# Altium schematic sheet Steering_Daughterboard.SchDoc
size A4; SheetNumber: 2; SheetTotal: 2
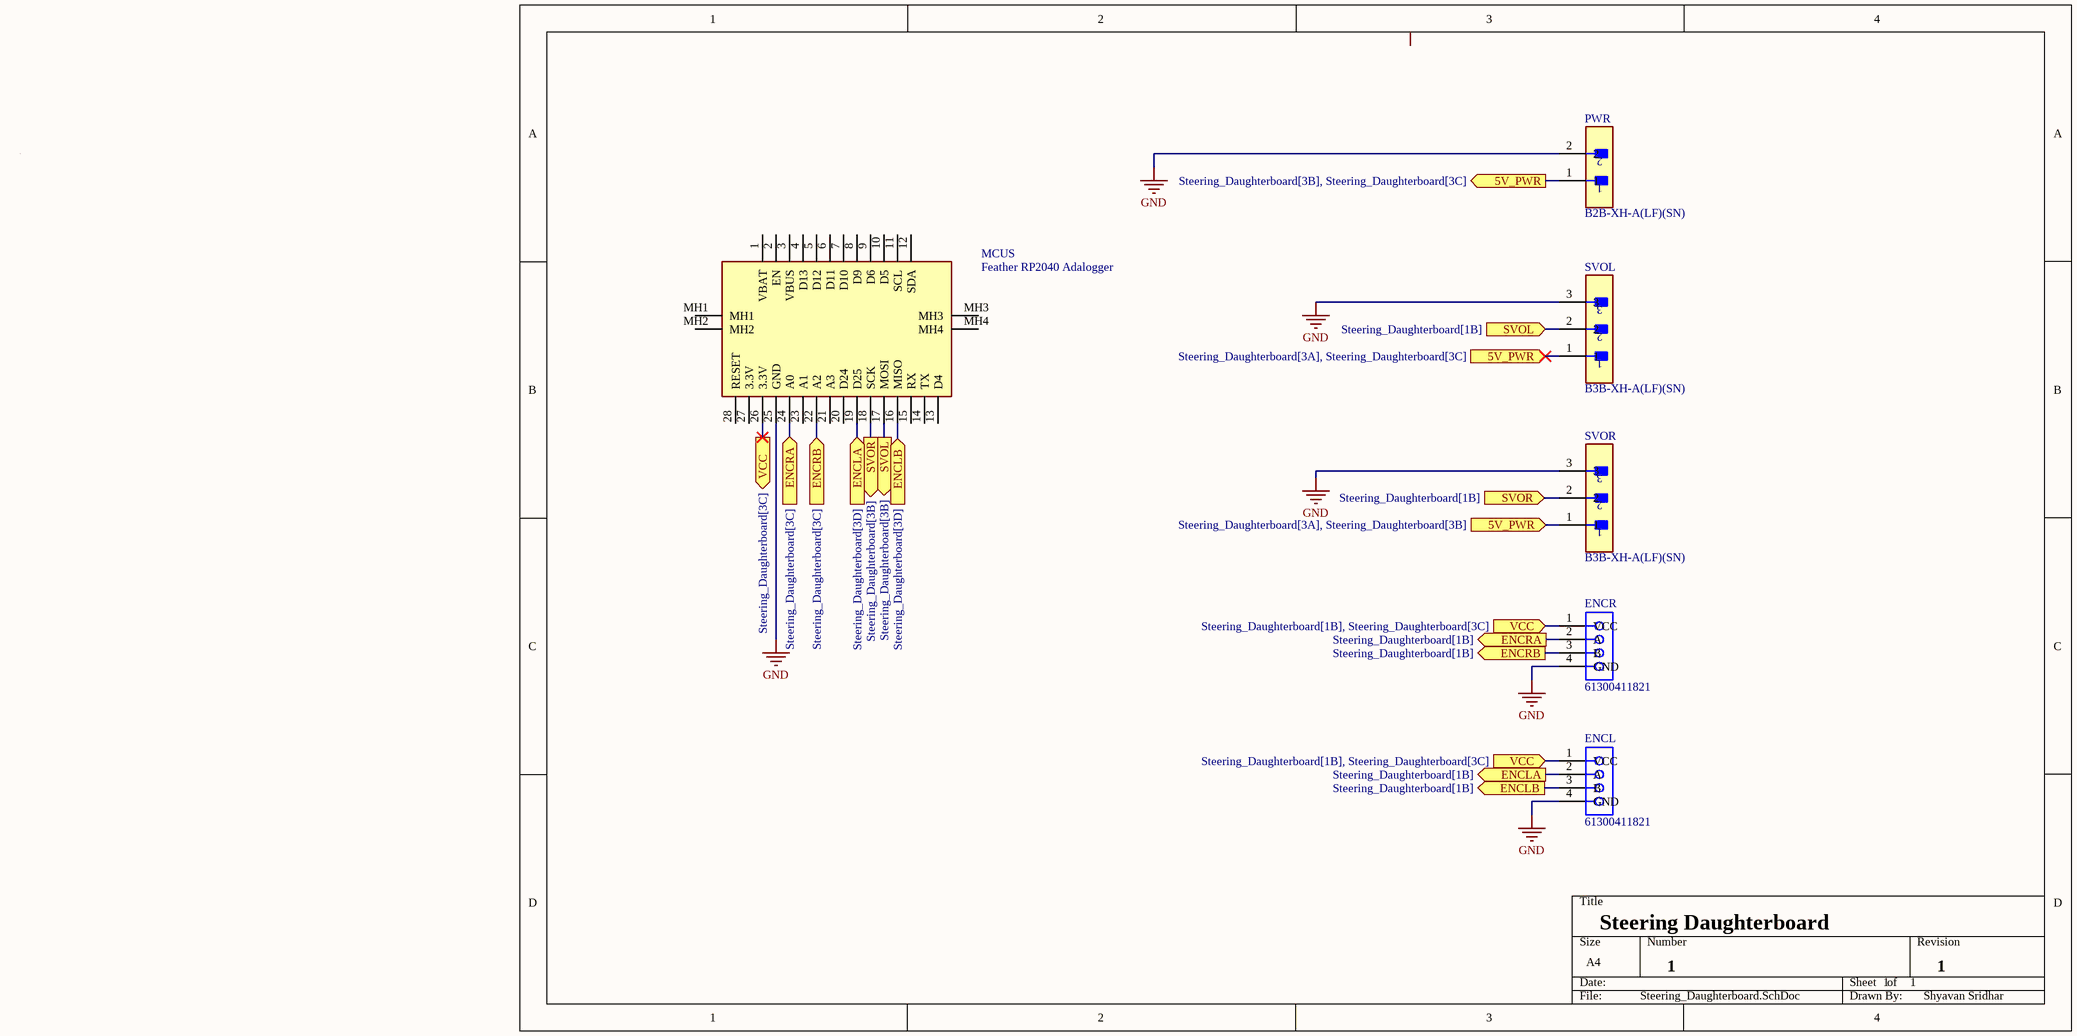
[diagram p0: Steering_Daughterboard.SchDoc]

## Parts
ENCL  61300411821  [61300411821]
ENCR  61300411821  [61300411821]
MCUS  Feather RP2040 Adalogger  [2796]
PWR  B2B-XH-A(LF)(SN)  [FP-B2B-XH-A_LF_SN-MFG]
SVOL  B3B-XH-A(LF)(SN)  [FP-B3B-XH-A_LF_SN-MFG]
SVOR  B3B-XH-A(LF)(SN)  [FP-B3B-XH-A_LF_SN-MFG]

## Ports
5V_PWR (in, see Steering_Daughterboard[3A], Steering_Daughterboard[3B]), 5V_PWR (in, see Steering_Daughterboard[3A], Steering_Daughterboard[3C]), 5V_PWR (out, see Steering_Daughterboard[3B], Steering_Daughterboard[3C]), ENCLA (in, see Steering_Daughterboard[3D]), ENCLA (out, see Steering_Daughterboard[1B]), ENCLB (in, see Steering_Daughterboard[3D]), ENCLB (out, see Steering_Daughterboard[1B]), ENCRA (in, see Steering_Daughterboard[3C]), ENCRA (out, see Steering_Daughterboard[1B]), ENCRB (in, see Steering_Daughterboard[3C]), ENCRB (out, see Steering_Daughterboard[1B]), SVOL (in, see Steering_Daughterboard[1B]), SVOL (out, see Steering_Daughterboard[3B]), SVOR (in, see Steering_Daughterboard[1B]), SVOR (out, see Steering_Daughterboard[3B]), VCC (in, see Steering_Daughterboard[1B], Steering_Daughterboard[3C]), VCC (out, see Steering_Daughterboard[3C])

## Nets
GND: ENCL.4(GND) ENCR.4(GND) MCUS.25(GND) PWR.2 SVOL.3 SVOR.3
5V_PWR: PWR.1 SVOL.1 SVOR.1 ; port 5V_PWR
ENCLA: ENCL.2(A) MCUS.19(D25) ; port ENCLA
ENCLB: ENCL.3(B) MCUS.16(MISO) ; port ENCLB
ENCRA: ENCR.2(A) MCUS.24(A0) ; port ENCRA
ENCRB: ENCR.3(B) MCUS.22(A2) ; port ENCRB
SVOL: MCUS.17(MOSI) SVOL.2 ; port SVOL
SVOR: MCUS.18(SCK) SVOR.2 ; port SVOR
VCC: ENCL.1(VCC) ENCR.1(VCC) MCUS.26(3.3V) ; port VCC

Not connected (* = marked no-connect by the designer): MCUS 1(VBAT) 2(EN) 3(VBUS) 4(D13) 5(D12) 6(D11) 7(D10) 8(D9) 9(D6) 10(D5) 11(SCL) 12(SDA) 13(D4) 14(TX) 15(RX) 20(D24) 21(A3) 23(A1) 27(3.3V) 28(RESET) MH1 MH2 MH3 MH4

## Notes on the sheet
- Steering Daughterboard
- 1
- Shyavan Sridhar

## Library data of the parts
ENCL ENCR = CMP-1502-01316-3: NexarPartId: 61924712; Contact Resistance: 20mΩ; Gender: Female; Current Rating: 3A; Operating Supply Voltage: 250V; RoHS: Non-Compliant; Number of Pins: 4; Orientation: Vertical; Lead Pitch: 2.54mm
MCUS = 2796: Adafruit Microcontroller; Manufacturer_Part_Number: 4884; Datasheet Link: https://learn.adafruit.com/adafruit-feather-rp2040-adalogger/; Height: 8mm; Manufacturer_Name: Adafruit; Mouser Part Number: 485-5980; Mouser Price/Stock: https://www.mouser.com/ProductDetail/Adafruit/5980?qs=IKkN%2F947nfCnlS5PgbpnkA%3D%3D; Arrow Part Number: 4884; Arrow Price/Stock: https://www.arrow.com/en/products/4884/adafruit-industries
PWR = CMP-2000-05888-3: CONN HEADER VERT 2POS 2.5MM; Current Rating: 3A; Voltage Rating: 250V; Number of Contacts: 2; Contact Resistance: 20mR; Wire/Cable Gauge: 22AWG; Insulation Resistance: 1GR; Connector Type: Male Pin; Packaging: Bulk; Contact Material: Brass; Lead Free: Lead Free; Orientation: Straight; Contact Plating: Tin; Max Current Rating: 3A; Termination: Solder; Fastening Type: Detent; Depth: 5.75mm; Housing Material: Polyamide; REACH SVHC: No SVHC; Series: XH; Voltage Rating (AC): 250V; Number of Positions: 2; Color: Natural; Contact Type: Male Pin; Max Voltage Rating (DC): 250V; Pitch: 2.5mm; Lead Pitch: 2.5mm; Mount: Through Hole; Max Operating Temperature: 85°C; Length: 7.4mm; Max Voltage Rating (AC): 250V; Min Operating Temperature: -25°C; Number of Rows: 1; Housing Color: White
SVOL SVOR = CMP-17439-000014-3: CONN HEADER VERT 3POS 2.5MM; Max Voltage Rating (DC): 250V; Number of Positions: 3; Current Rating: 3A; Gender: Male; Wire/Cable Gauge: 22AWG; Contact Resistance: 20mR; Insulation Resistance: 1GR; Insulation Material: Nylon; Contact Plating: Tin; Depth: 5.75mm; Contact Type: Male Pin; Max Operating Temperature: 85°C; Insulation Color: Natural; Voltage Rating (AC): 250V; Color: Natural; Connector Type: Header; Orientation: Straight; Fastening Type: Detent; Housing Color: White; Min Operating Temperature: -25°C; Termination: Solder; Voltage Rating: 250V; Series: XH; Pitch: 2.5mm; Contact Shape: Square; Number of Rows: 1; Lead Free: Lead Free; Packaging: Bulk; Mount: Through Hole; Flammability Rating: UL94 V-0; Max Voltage Rating (AC): 250V; REACH SVHC: No SVHC; Housing Material: Polyamide; Contact Material: Brass; Lead Pitch: 2.5mm; Contact Finish - Mating: TIN; Length: 9.9mm; Max Current Rating: 3A; Number of Contacts: 3